# EAGLE design audio-amp-v1 (EAGLE 7.3.0)
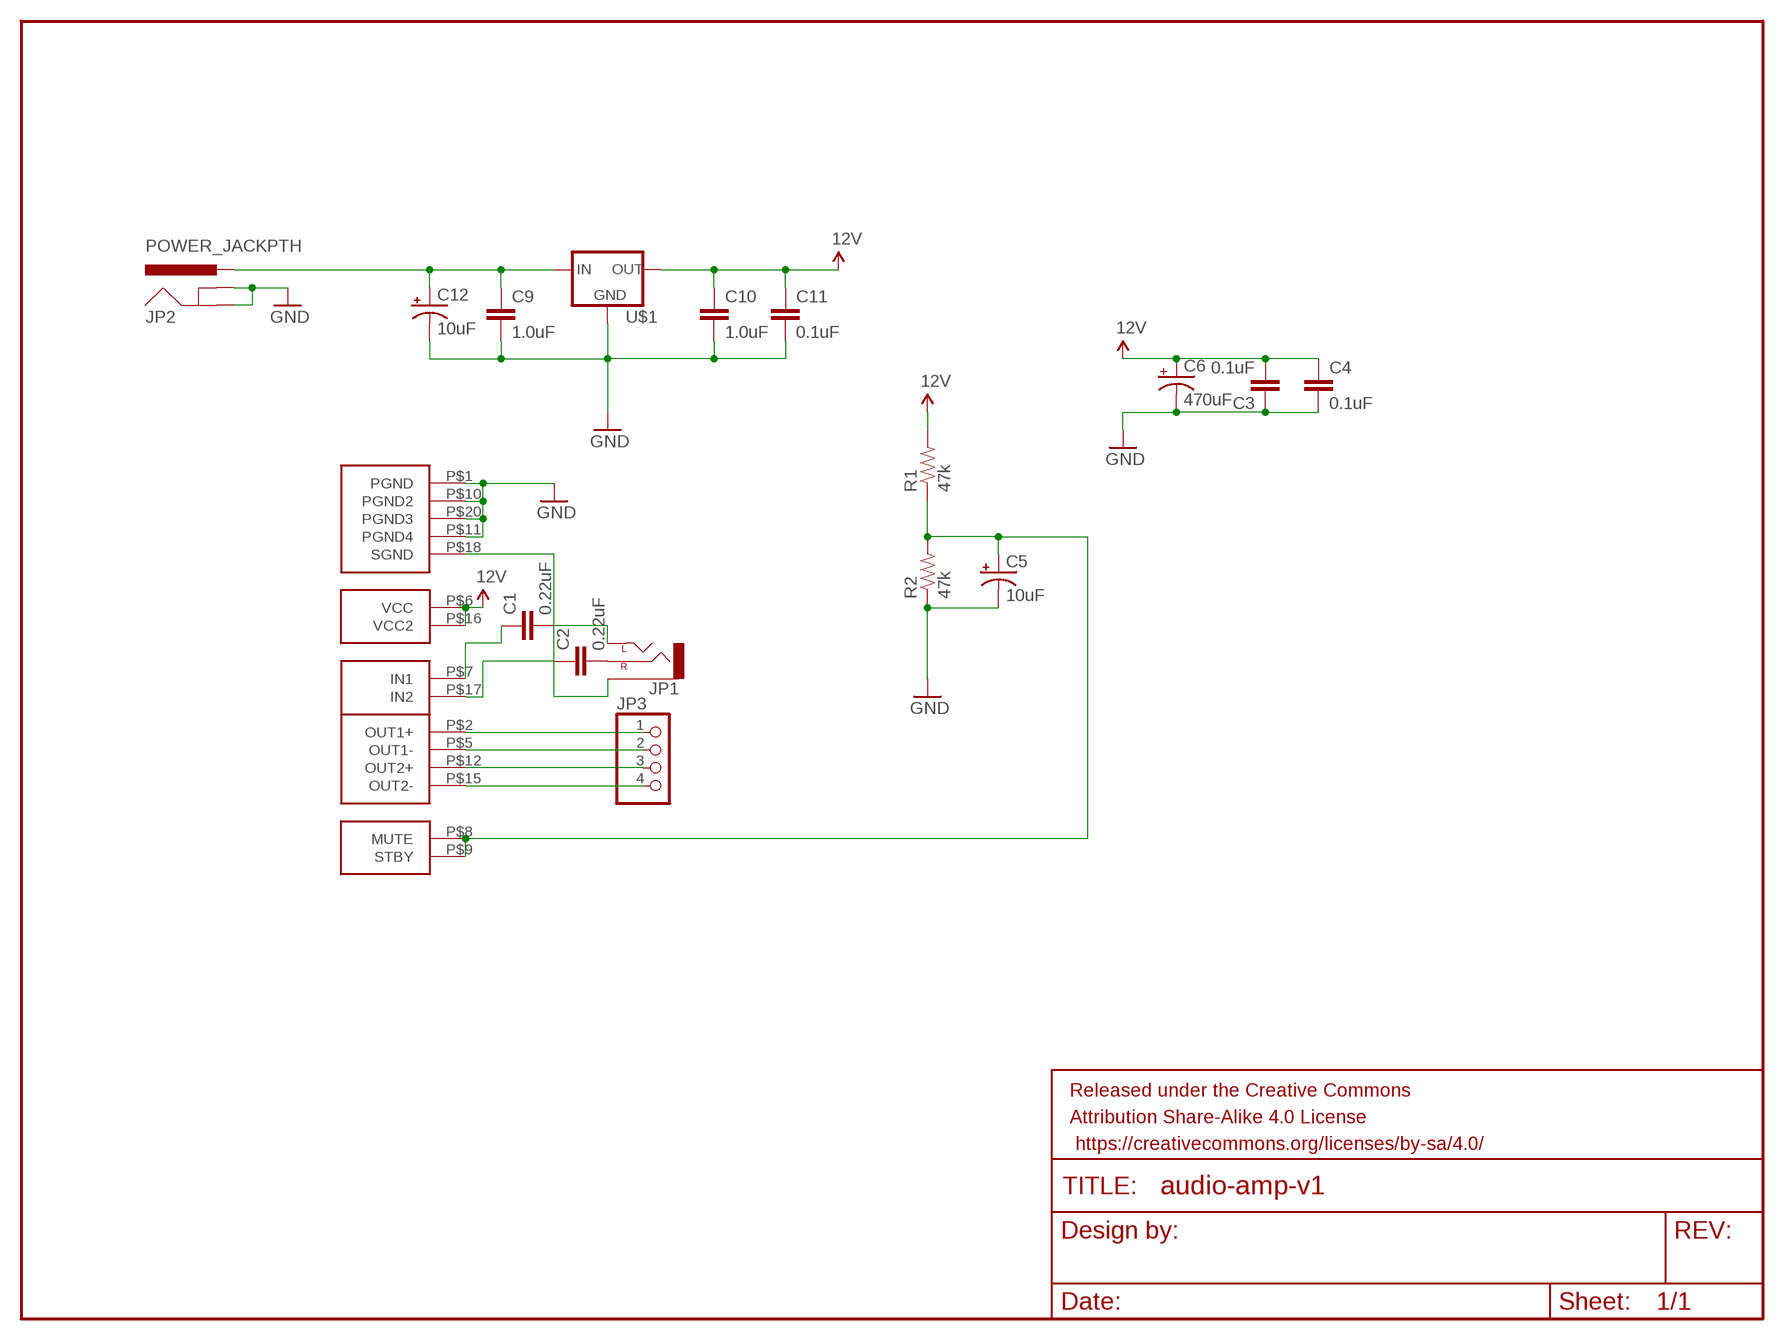
[diagram p0: schematic, sheet 1]

## Parts
C1  0.22uF  0.22UF-25V-10%(0603)  [0603-CAP]
C2  0.22uF  0.22UF-25V-10%(0603)  [0603-CAP]
C3  0.1uF  0.1UF-25V-5%(0603)  [0603-CAP]
C4  0.1uF  0.1UF-25V-5%(0603)  [0603-CAP]
C5  10uF  CAP_POLC  [PANASONIC_C]
C6  470uF  100UF-63V-20%(ELECT)  [NIC_10X10.5_CAP]
C9  1.0uF  1.0UF-16V-10%(0603)  [0603-CAP]
C10  1.0uF  1.0UF-16V-10%(0603)  [0603-CAP]
C11  0.1uF  1.0UF-16V-10%(0603)  [0603-CAP]
C12  10uF  CAP_POLC  [PANASONIC_C]
FRAME1  FRAME-LETTERNO_PACKAGE  [DUMMY]
JP1  AUDIO-JACKSMD2  [AUDIO-JACK-3.5MM-SMD]
JP2  POWER_JACKPTH  [POWER_JACK_PTH]
JP3  PINHD-1X4  [1X04]
R1  47k  RESISTOR0603-RES  [0603-RES]
R2  47k  RESISTOR0603-RES  [0603-RES]
U$1  V_REG_78XX-TO-220  [TO-220-ALT]
U$2  TDA7266D  [TDA7266D]

## Nets
5V: C3.2 C4.1 C6.+ C10.1 C11.1 R1.2 U$1.OUT U$2.P$6(VCC) U$2.P$16(VCC2) ; supply symbol labelled 12V
GND: C3.1 C4.2 C5.- C6.- C9.2 C10.2 C11.2 C12.- JP2.GND JP2.GNDBREAK R2.1 U$1.GND U$2.P$1(PGND) U$2.P$10(PGND2) U$2.P$11(PGND4) U$2.P$20(PGND3)
N$1: C2.1 U$2.P$17(IN2)
N$2: C1.1 U$2.P$7(IN1)
N$3: JP3.1 U$2.P$2(OUT1+)
N$4: JP3.2 U$2.P$5(OUT1-)
N$5: JP3.3 U$2.P$12(OUT2+)
N$6: JP3.4 U$2.P$15(OUT2-)
N$7: JP1.SLEEVE U$2.P$18(SGND)
N$8: C2.2 JP1.RING(RIGHT)
N$9: C1.2 JP1.TIP(LEFT)
N$10: C5.+ R1.1 R2.2 U$2.P$8(MUTE) U$2.P$9(STBY)
N$12: C9.1 C12.+ JP2.PWR U$1.IN

## Library data of the parts
C1 C2 = SparkFun-Capacitors:0.22UF-25V-10%(0603): CAP-07822; PROD_ID: CAP-07822
C3 C4 = SparkFun-Capacitors:0.1UF-25V-5%(0603): CAP-08604; PROD_ID: CAP-08604
C5 C12 = SparkFun-Capacitors:CAP_POL: Capacitor Polarized These are standard SMD and PTH capacitors. Normally 10uF, 47uF, and 100uF in electrolytic and tantalum varieties. Always verify the external diameter of the through hole cap, it varies with capacity, voltage, and manufacturer. The EIA devices should be standard.
C6 = SparkFun-Capacitors:100UF-63V-20%(ELECT): CAP-08362 100uF electrolytic SMT 63V 20%; PROD_ID: CAP-08362; VALUE: 100uF
C9 C10 = SparkFun-Capacitors:1.0UF-16V-10%(0603): CAP-00868; PROD_ID: CAP-00868
C11 = SparkFun-Capacitors:1.0UF-16V-10%(0603): CAP-00868; PROD_ID: CAP-00868; VALUE: 1.0uF
FRAME1 = SparkFun-Aesthetics:FRAME-LETTER: Schematic Frame Standard 8.5x11 US Letter frame; DESIGNER: Nobody; VERSION: v01
JP1 = SparkFun-Connectors:AUDIO-JACK: 3.5mm Audio Jack Simple 3.5mm common PCB mount audio jack. Variant PTH is our storefront SKU PRT-08032; PROD_ID: CONN-10353
JP2 = SparkFun-Connectors:POWER_JACK: Power Jack This is the standard 5.5mm barrel jack for power. The PTH is the most common, proven, reliable, footprint. The Slot footprint only works if the mill layer is transmitted to the PCB fab house so be warned. Mating wall wart : TOL-00298 (and others); PROD_ID: CONN-08197
JP3 = pinhead:PINHD-1X4: PIN HEADER
R1 R2 = SparkFun-Passives:RESISTOR: Resistor Basic schematic elements and footprints for 0603, 1206, and PTH resistors.
U$1 = SparkFun-PowerIC:V_REG_78XX: Voltage Regulator Standard 78xx regulator. IGO (Input Ground Output). Spark Fun Electronics SKU : COM-00107; PROD_ID: VREG-08450; SF_ID: COM-00107
U$2 = TDA7266D:TDA7266D

## Board
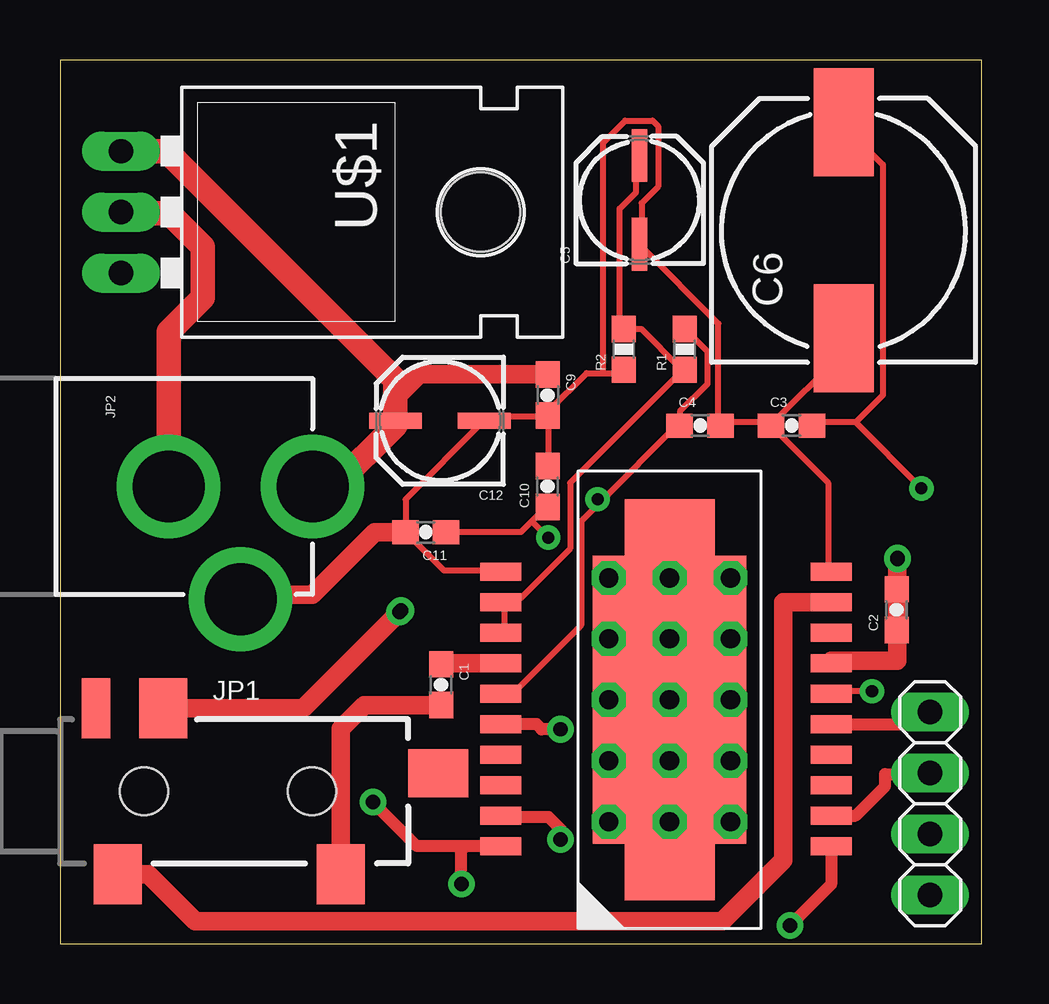
[diagram p1: board, top side]
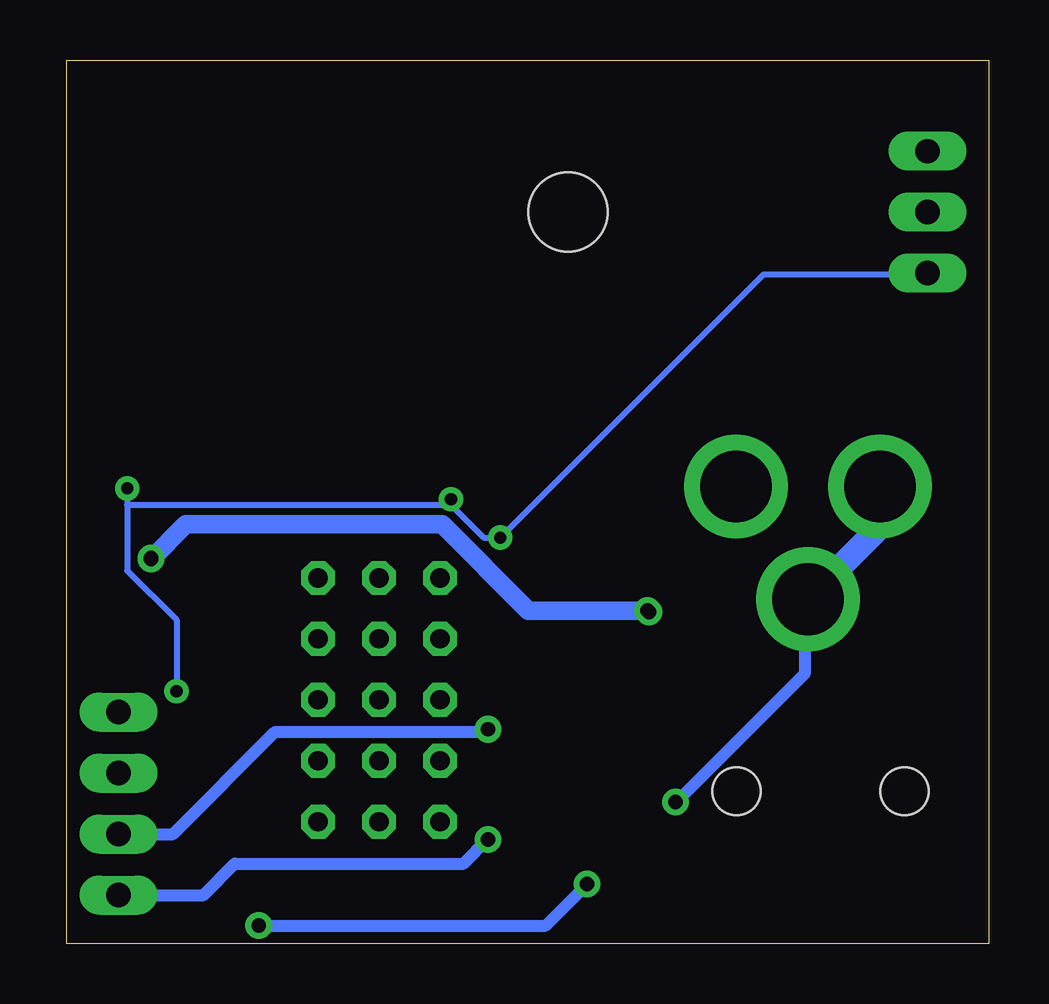
[diagram p2: board, bottom side, seen from below]

Size 38.41 x 36.82 mm. Coordinates in mm from the lower left corner, seen from the top.
Outline: 0,0 38.41,0 38.41,36.82 0,36.82 0,0
Copper layers (1*16): Top 0.035mm / dielectric 1.5mm / Bottom 0.035mm
Design rules "default *": minimum track width 10mil, minimum drill 20mil, track to track 8mil, track to pad 8mil, pad to pad 8mil, via to via 8mil, smd to smd 8mil, copper to edge 10mil, drill to drill 8mil, minimum pad ring 12mil, minimum via ring 10mil, stop-mask expansion 4mil, vias tented up to drill 25mil, thermal gap 10mil

### Footprints (pad centres in the part's own frame; a part is rotated, then mirrored left to right if it is on the bottom)
0603-CAP = smd 1.1 x 1: 1 -0.85,0; 2 0.85,0
PANASONIC_C = smd 2.2 x 0.65: + 1.9,-0.2; - -1.8,-0.2
NIC_10X10.5_CAP = smd 4.5 x 2.5: + 4.5,0; - -4.5,0
AUDIO-JACK-3.5MM-SMD = smd 2 x 2.5: RING 4.3,3.45; SLEEVE 2.4,-3.45; TIP 11.7,-3.45 | smd 1.2 x 2.5: RSH 1.5,3.45 | smd 2.5 x 2: TSH 15.75,0.75 | hole 2: 3.5,0; 10.5,0
POWER_JACK_PTH = drill 2.997 pad 4.318: GND 0,7.7; GNDBREAK 4.7,10.7; PWR 0,13.7
1X04 = drill 1.016 long: 1 -3.81,0; 2 -1.27,0; 3 1.27,0; 4 3.81,0
0603-RES = smd 1.1 x 1: 1 -0.85,0; 2 0.85,0
TO-220-ALT = drill 1.016 long: GND 0,-3.81; IN -2.54,-3.81; OUT 2.54,-3.81 | hole 3.302: 0,11.176
TDA7266D = smd 0.76 x 1.7: P$1 -6.095,7.032; P$2 -4.825,7.032; P$3 -3.555,7.032; P$4 -2.285,7.032; P$5 -1.015,7.032; P$6 0.255,7.032; P$7 1.525,7.032; P$8 2.795,7.032; P$9 4.065,7.032; P$10 5.335,7.032; P$11 -6.095,-6.732; P$12 -4.825,-6.732; P$13 -3.555,-6.732; P$14 -2.285,-6.732; P$15 -1.015,-6.732; P$16 0.255,-6.732; P$17 1.525,-6.732; P$18 4.065,-6.732; P$19 2.795,-6.732; P$20 5.335,-6.732 | smd 12 x 6.4: P$21 0,0 | smd 2.35 x 3.75: P$22 7.175,0; P$23 -7.175,0 | drill 0.8 octagon: P$24 -5.08,2.54; P$25 -2.54,2.54; P$26 0,2.54; P$27 2.54,2.54; P$28 5.08,2.54; P$29 5.08,0; P$30 2.54,0; P$31 0,0; P$32 -2.54,0; P$33 -5.08,0; P$34 -5.08,-2.54; P$35 -2.54,-2.54; P$36 0,-2.54; P$37 2.54,-2.54; P$38 5.08,-2.54

### Placement (x,y rotation side)
C1  15.88,10.79 270 top
C2  34.86,13.92 90 top
C3  30.48,21.59 0 top
C4  26.67,21.59 0 top
C5  23.95,30.94 90 top
C6  32.65,29.72 90 top
C9  20.32,22.86 270 top
C10  20.32,19.05 90 top
C11  15.24,17.14 180 top
C12  15.88,21.59 180 top
FRAME1  -17.78,11.43 0 top  (outside the outline)
JP1  0,6.35 0 top
JP2  -3.17,19.05 270 top
JP3  36.25,5.84 90 top
R1  26.04,24.77 90 top
R2  23.5,24.77 90 top
U$1  6.35,30.48 270 top
U$2  25.4,10.16 90 top

### Tracks (layer width: path | path; a pad name or v marks a point on that pad's centre or on a via)
5V  (via drill 0.51)
  Top 0.254: R1.2 26.06,25.6 26.98,24.69 26.98,23.32 25.83,22.17 25.83,21.72 C4.1 25.6,21.49 22.63,18.52 | 22.63,18.52 21.72,17.6 21.72,13.26 18.97,10.52 18.52,10.52 U$2.P$6 | C11.1 19.2,17.14 19.66,17.6 | 19.66,17.6 20.12,18.06 C10.1 | 33.15,21.72 31.55,21.72 C3.2 | 33.15,21.72 34.29,22.86 34.29,32.46 32.69,34.06 C6.+ | v33.83,10.52 32.23,10.52 U$2.P$16 | 33.15,21.72 v35.89,18.97 | v20.34,16.92 19.66,17.6 | v22.4,18.52 22.63,18.52
  Bottom 0.254: v33.83,10.52 33.83,13.49 35.89,15.54 35.89,18.29 | v35.89,18.97 35.89,18.29 | 22.4,18.29 21.03,16.92 v20.34,16.92 9.37,27.89 2.74,27.89 U$1.OUT | 35.89,18.29 22.4,18.29 | 22.4,18.29 v22.4,18.52
GND  (via drill 0.6)
  Top 0.254: C10.2 20.34,20.12 20.34,21.95 C9.2 | C3.1 29.49,21.72 27.66,21.72 C4.2 27.43,21.72 27.43,25.83 24.23,29.03 C5.- 24.23,29.26 24.23,30.86 24.92,31.55 24.92,34.06 24.69,34.29 23.55,34.29 22.63,33.38 22.63,23.77 | U$2.P$20 32,15.54 32,19.2 29.72,21.49 C3.1 | C6.- 32.46,25.15 32.46,24.46 29.72,21.72 C3.1 | 14.4,17.14 16,15.54 18.29,15.54 U$2.P$10 | 22.63,23.77 21.95,23.77 20.34,22.17 C9.2 | 22.63,23.77 23.32,23.77 R2.1 | C9.2 20.12,21.95 17.83,21.95 C12.- 17.6,21.72 14.4,18.52 14.4,17.14 | 14.4,17.14 C11.2
  Top 0.508: U$2.P$1 16.9,4.07 | 16.9,4.07 14.87,4.07 v13.04,5.9 | U$2.P$11 32.13,2.47 v30.41,0.75 | v16.73,2.48 16.73,3.89 16.9,4.07
  Top 0.762: 14.4,17.14 13.11,17.14 10.5,14.54 7.71,14.54 JP2.GNDBREAK
  Top 1.016: JP2.GND 4.53,25.49 5.95,26.92 5.95,29.04 4.55,30.44 2.58,30.44 U$1.GND
  Bottom 0.508: v13.04,5.9 13.02,5.9 7.64,11.28 7.64,14.24 JP2.GNDBREAK | v30.41,0.75 18.46,0.75 v16.73,2.48
  Bottom 1.016: JP2.GND 4.53,17.35 JP2.GNDBREAK
N$1
  Top 0.762: C2.1 34.88,13.07 34.88,11.78 32.13,11.78 U$2.P$17
N$2
  Top 0.762: U$2.P$7 15.91,11.69 C1.1
N$3  (via drill 0.6)
  Top 0.508: v20.86,4.34 20.86,4.78 20.36,5.28 18.43,5.28 U$2.P$2
  Bottom 0.508: JP3.1 32.71,2.03 31.4,3.33 21.87,3.33 v20.86,4.34
N$4  (via drill 0.6)
  Top 0.508: v20.86,8.93 20.07,8.93 19.86,9.15 U$2.P$5
  Bottom 0.508: JP3.2 33.98,4.57 29.72,8.83 20.97,8.83 v20.86,8.93
N$5
  Top 0.508: U$2.P$12 33.15,5.33 34.38,6.57 34.38,7.07 36.21,7.07 JP3.3
N$6
  Top 0.508: U$2.P$15 35.75,9.14 JP3.4
N$7
  Top 0.762: JP1.SLEEVE 3.67,2.9 5.64,0.93 27.59,0.93 30.13,3.47 30.14,3.47 30.14,14.22 32.13,14.22 U$2.P$18
N$8  (via drill 0.6)
  Top 0.762: JP1.RING 10.13,9.8 v14.15,13.82 v14.21,13.88 | v34.89,16.02 34.89,13.57 C2.2
  Bottom 0.762: v14.21,13.88 19.17,13.88 22.76,17.47 33.45,17.47 v34.89,16.02
N$9
  Top 0.762: JP1.TIP 11.7,8.96 12.67,9.93 15.86,9.93 C1.2
N$10
  Top 0.254: U$2.P$8 18.52,13.03 18.52,14.17 U$2.P$9 18.52,14.4 19.2,14.4 21.26,16.46 21.26,19.2 25.83,23.77 R1.1 25.83,24 24.23,25.6 23.55,25.6 R2.2 23.32,25.83 23.32,30.63 24,31.32 24,32.69 C5.+
N$11  (via drill 0.6)
  other vias: 34.89,16.08
N$12
  Top 0.762: C12.+ 13.97,22.73 14.97,23.73 20.3,23.73 C9.1
  Top 1.016: U$1.IN 4.45,33.02 13.97,23.5 C12.+ | C12.+ | C12.+ 13.97,21.59 11.43,19.05 JP2.PWR